# EAGLE design twister3-controller (EAGLE 8.3.2)
DESIGNER: Jon Newman; DESIGN_NAME: Twister3 Control Board; LICENSE: CERN OHL v1.2; REVISION: 1.1
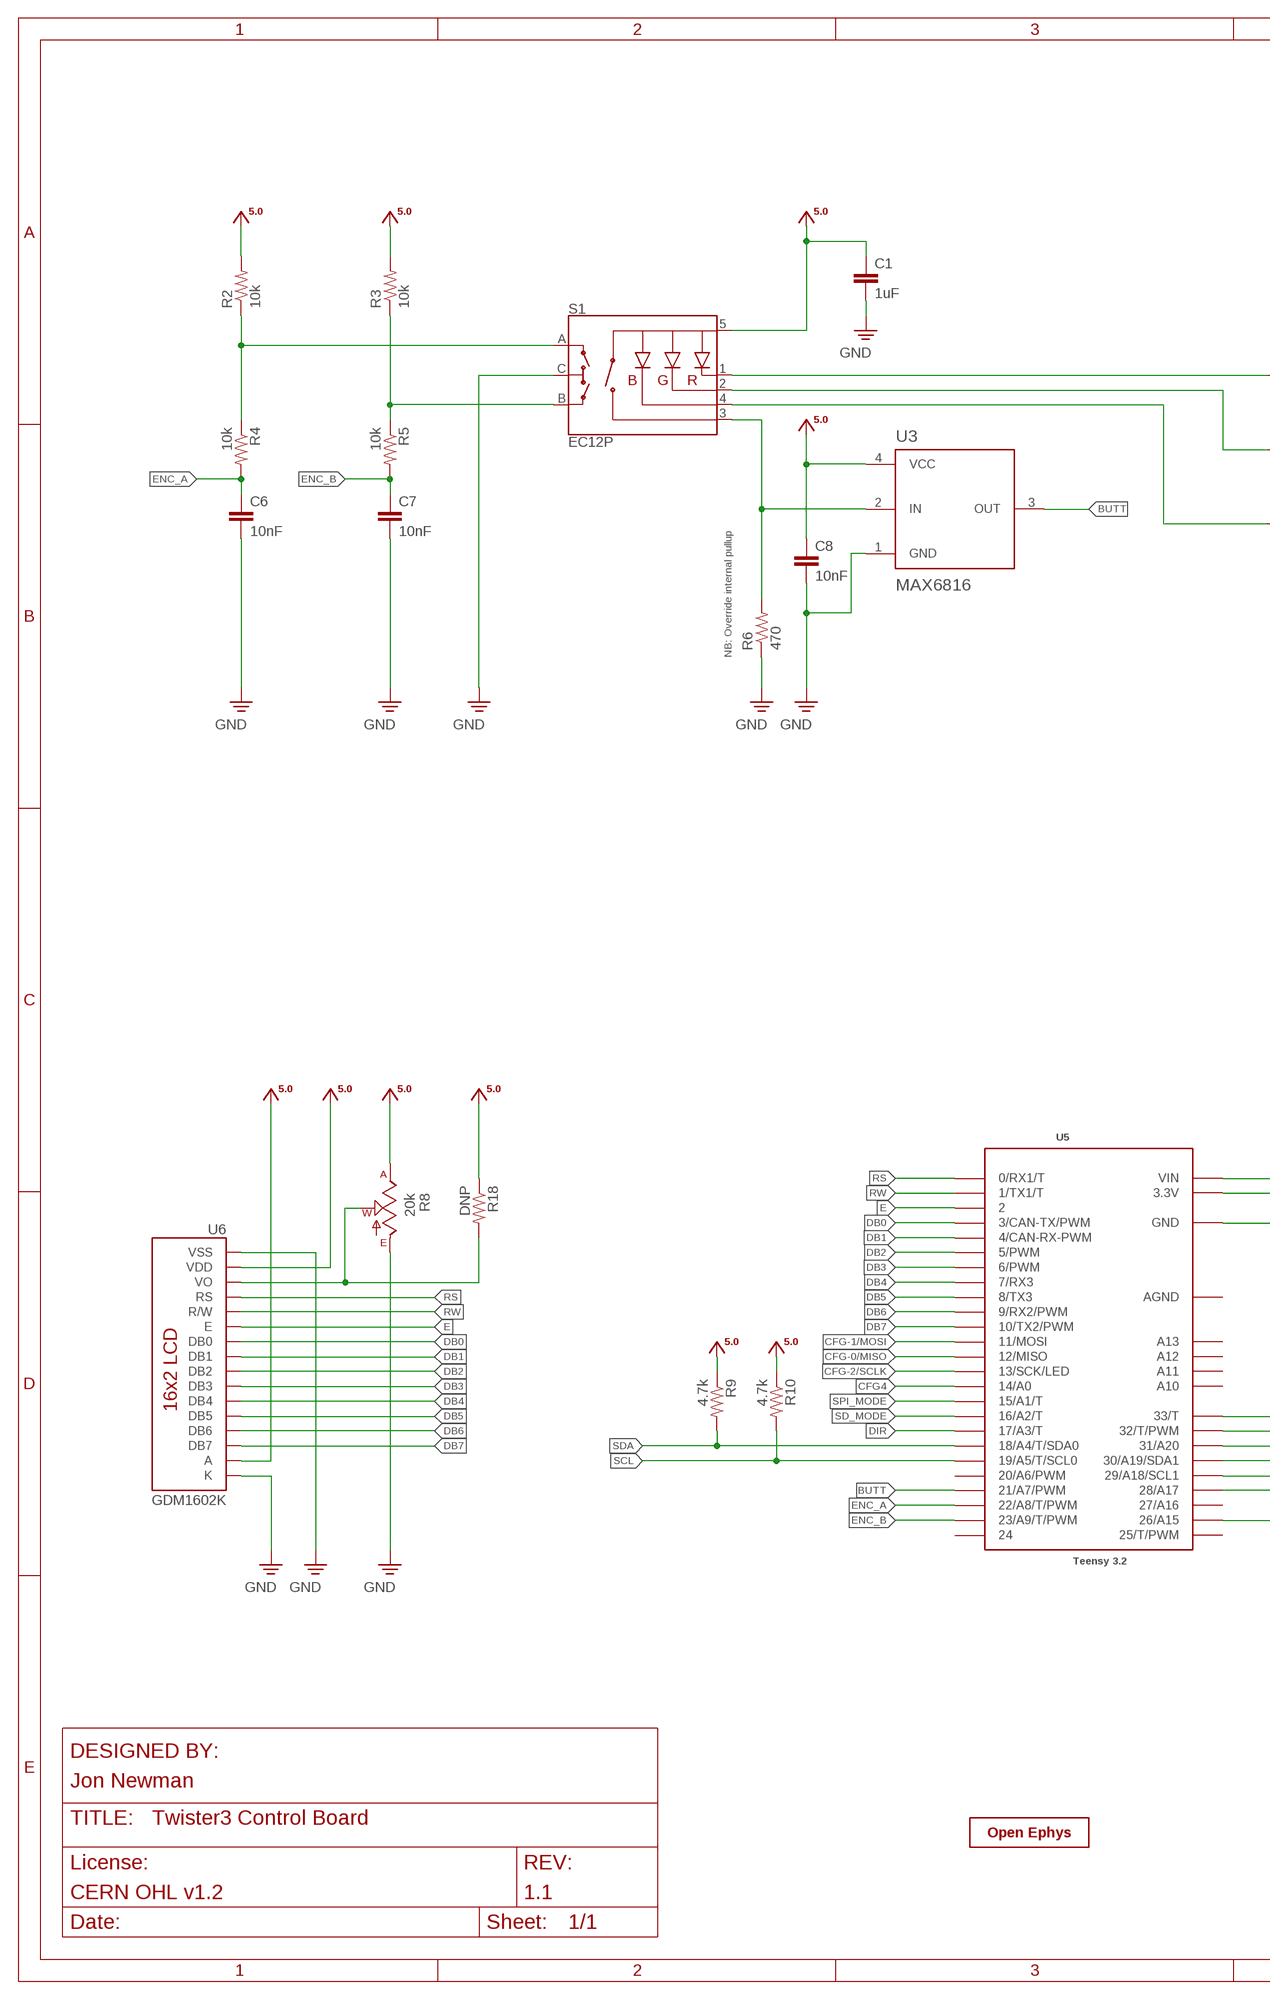
[diagram p0: schematic, sheet 1, part 1 of 2]
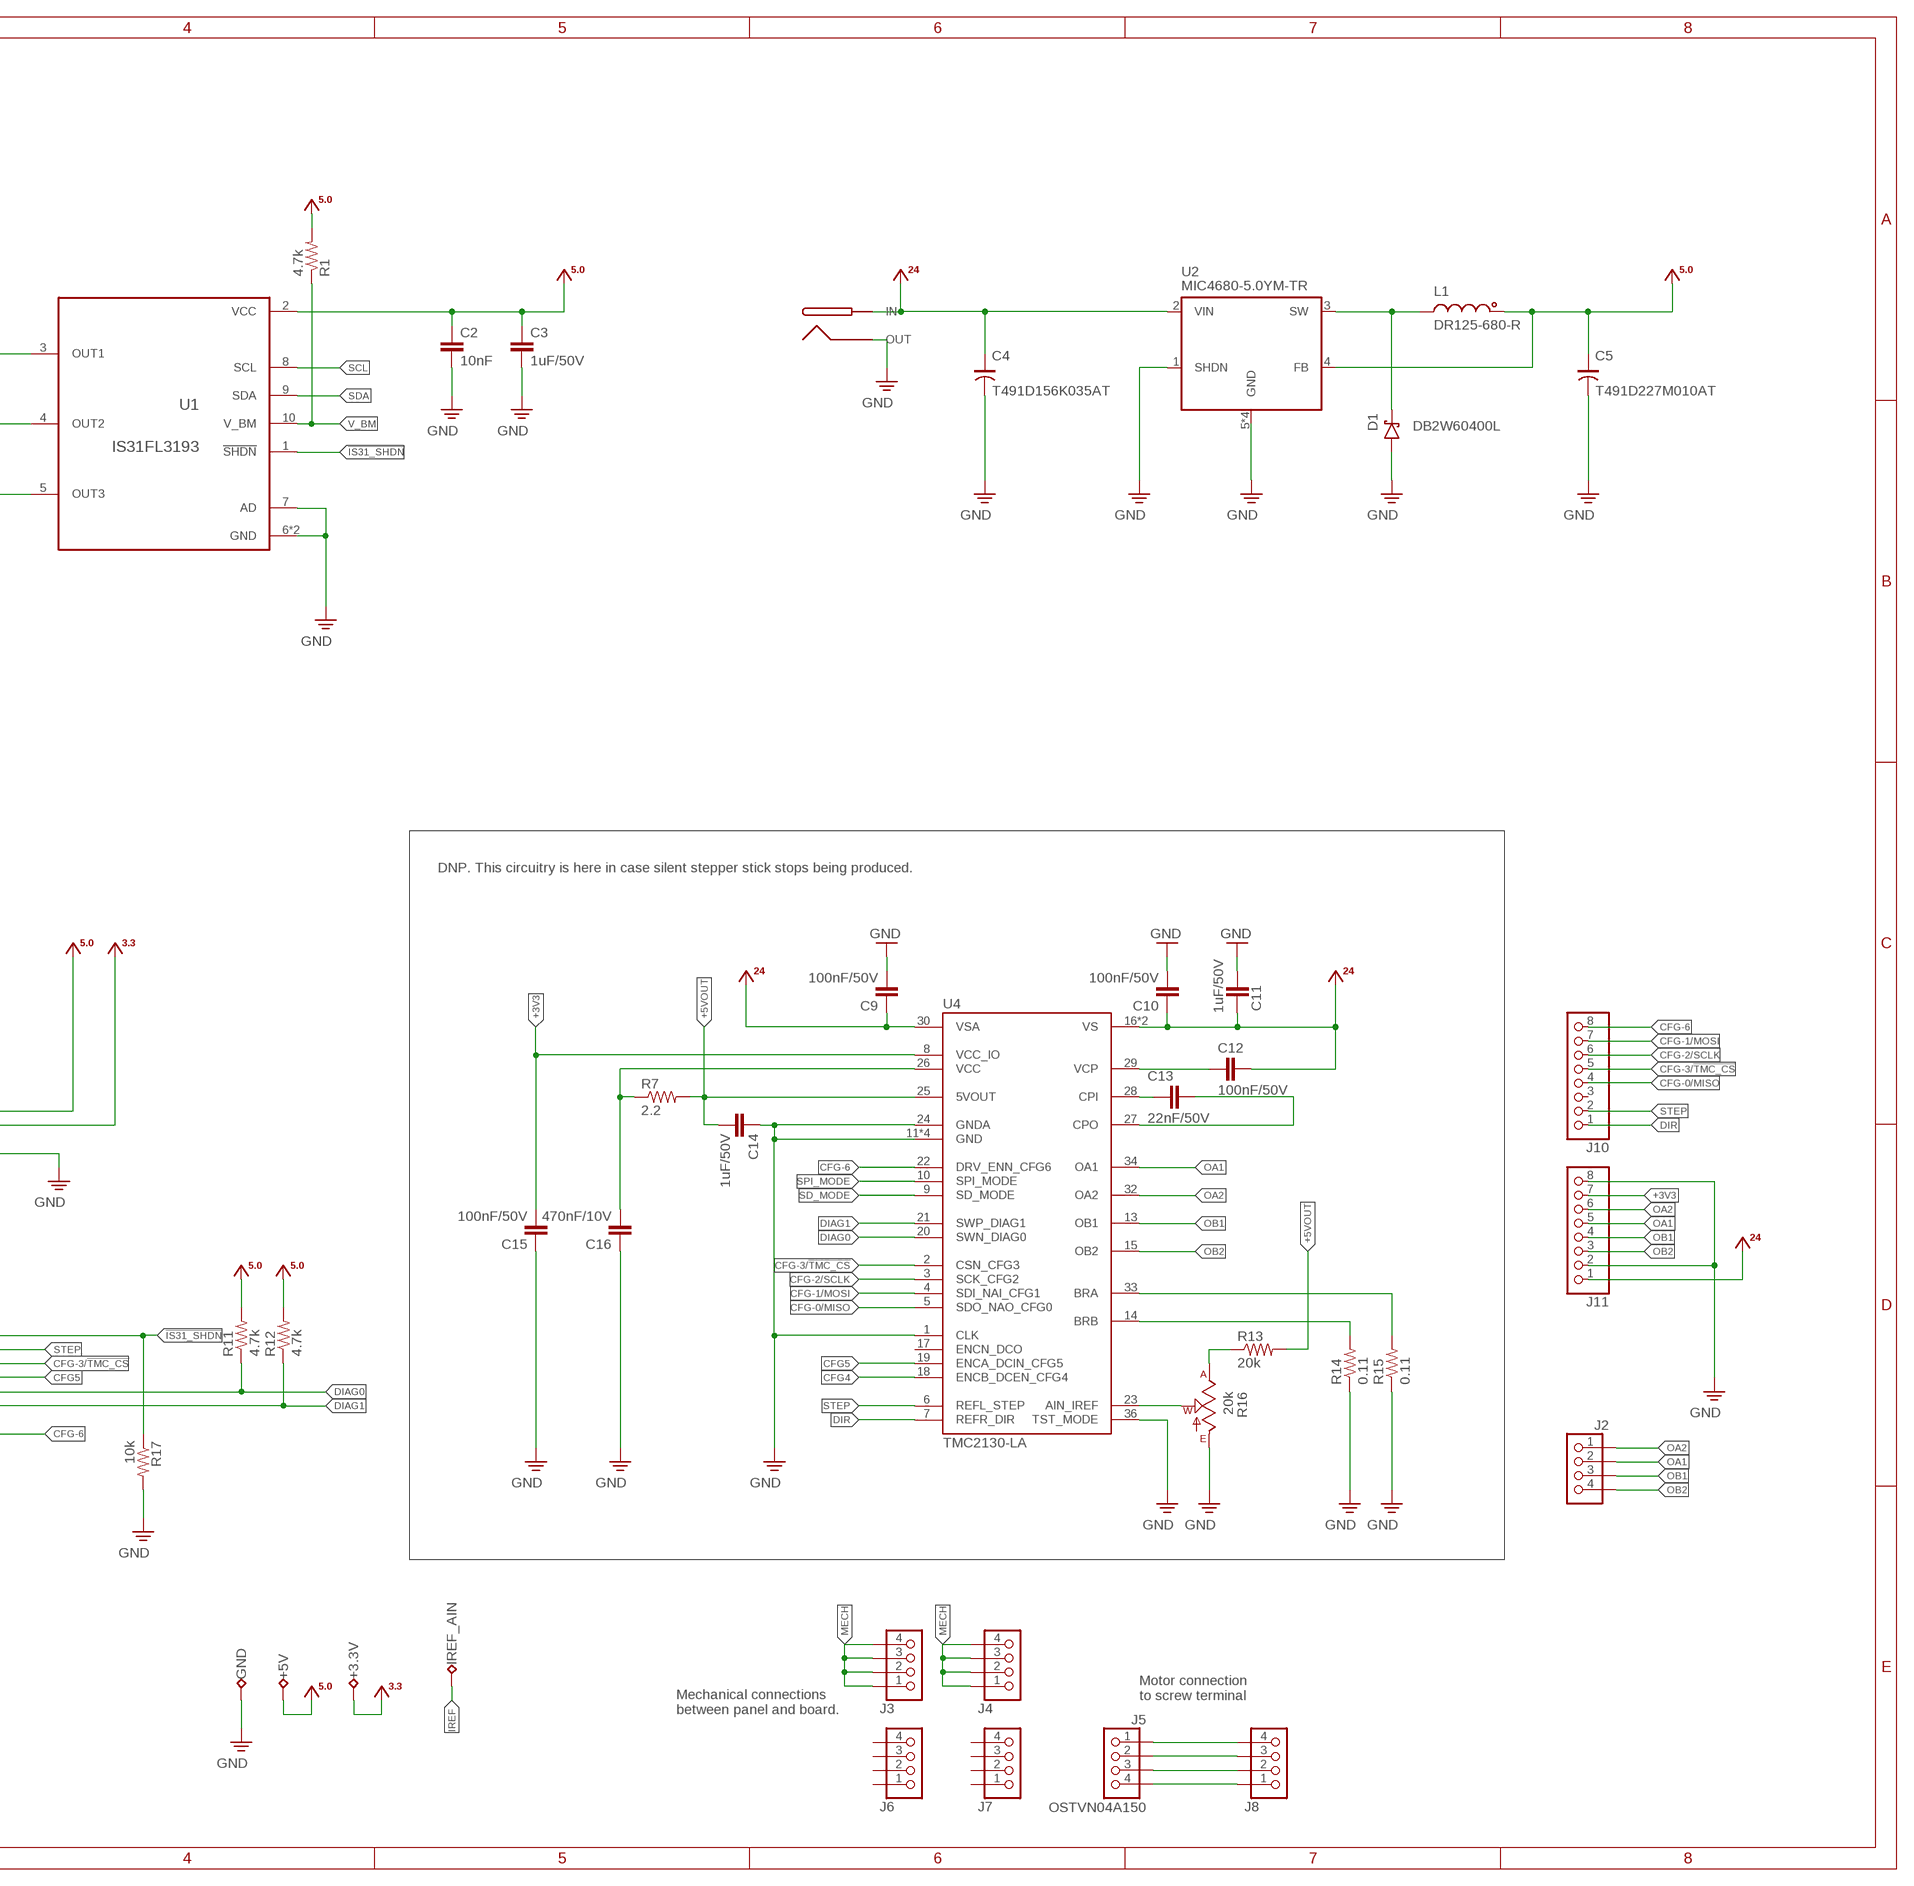
[diagram p1: schematic, sheet 1, part 2 of 2]

## Parts
+3.3V  TP_2MM  [TESTPOINT_2MM]
+5V  TP_2MM  [TESTPOINT_2MM]
C1  1uF  C_0603  [0603]
C2  10nF  C_0603  [0603]
C3  1uF/50V  C_0603  [0603]
C4  T491D156K035AT  C-POL_7343M  [7343M]
C5  T491D227M010AT  C-POL_7343M  [7343M]
C6  10nF  C_0603  [0603]
C7  10nF  C_0603  [0603]
C8  10nF  C_0603  [0603]
C9  100nF/50V  C_0603  [0603]
C10  100nF/50V  C_0603  [0603]
C11  1uF/50V  C_0603  [0603]
C12  100nF/50V  C_0603  [0603]
C13  22nF/50V  C_0402  [0402]
C14  1uF/50V  C_0603  [0603]
C15  100nF/50V  C_0603  [0603]
C16  470nF/10V  C_0402  [0402]
D1  DB2W60400L  S-DIODESOD-123  [SOD123]
GND  TP_2MM  [TESTPOINT_2MM]
IREF_AIN  TP_2MM  [TESTPOINT_2MM]
J1  BARREL-JACK_PJ-063BH  [PJ-063BH]
J2  PINHD-1X4  [1X04]
J3  PINHD-1X4_SMD-0.1"  [JP4_SMD]
J4  PINHD-1X4_SMD-0.1"  [JP4_SMD]
J5  OSTVN04A150  PINHD-1X4  [1X04]
J6  PINHD-1X4  [1X04]
J7  PINHD-1X4  [1X04]
J8  PINHD-1X4_SMD-0.1"  [JP4_SMD]
J10  PINHD-1X08_2.54-S  [1X08-S]
J11  PINHD-1X08_2.54-S  [1X08-S]
L1  DR125-680-R  L_DR125  [DR125]
R1  4.7k  R_0603  [0603]
R2  10k  R_0603  [0603]
R3  10k  R_0603  [0603]
R4  10k  R_0603  [0603]
R5  10k  R_0603  [0603]
R6  470  R_0603  [0603]
R7  2.2  R_0402  [0402]
R8  20k  TRIM_US-SM-42/43X  [SM-42/43X]
R9  4.7k  R_0603  [0603]
R10  4.7k  R_0603  [0603]
R11  4.7k  R_0603  [0603]
R12  4.7k  R_0603  [0603]
R13  20k  R_0603  [0603]
R14  0.11  R_0805  [0805]
R15  0.11  R_0805  [0805]
R16  20k  TRIM_US-SM-42/43X  [SM-42/43X]
R17  10k  R_0603  [0603]
R18  DNP  R_0603  [0603]
S1  EC12P  ENCODER-RGB-SWITCH  [ENCODER_LED_3]
U1  IS31FL3193  [PWSON-N10-3X3]
U2  MIC4680-5.0YM-TR  MIC4680_SOIC  [SOIC127P500X400-8N]
U3  MAX6816  [SOT143-4]
U4  TMC2130-LA  TMC21X0-LA  [QFN36-PAD]
U5  Teensy 3.2  TEENSY_3.1_CYCLOPS  [TEENSY_3.1_CYCLOPS]
U6  GDM1602K  LCD-16X2SILK  [LCD-16X2]
X1  OE-LOGO_14X10  [OE-LOGO-14X10]

## Nets
!IS31_SHDN: R17.1 U1.1(!SHDN) U5.33(33/T)
+3V3: +3.3V.1(TP) C15.2 J11.7 U4.8(VCC_IO) U5.3.3V U5.3.3V2(3.3V)
+5V0: +5V.1(TP) C1.1 C2.1 C3.1 C5.+ C8.1 L1.1 R1.2 R2.2 R3.2 R8.1(A) R9.1 R10.1 R11.2 R12.2 R18.1 S1.5(+) U1.2(VCC) U2.4(FB) U3.4(VCC) U5.VIN U6.2(VDD) U6.15(A)
+5VOUT: C14.2 R7.2 R13.2 U4.25(5VOUT)
+24V0: C4.+ C9.1 C10.1 C11.1 C12.1 J1.1(IN) J11.1 U2.2(VIN) U4.16(VS) U4.30(VSA) U4.31(VS) ; supply symbol labelled +24V
BRA1: R15.2 U4.33(BRA)
BRB1: R14.2 U4.14(BRB)
BUTT: U3.3(OUT) U5.21/A7(21/A7/PWM)
CFG4: U4.18(ENCB_DCEN_CFG4) U5.14/A0
CFG5: U4.19(ENCA_DCIN_CFG5) U5.30(30/A19/SDA1)
CFG-0/MISO: J10.4 U4.5(SDO_NAO_CFG0) U5.12(12/MISO)
CFG-1/MOSI: J10.7 U4.4(SDI_NAI_CFG1) U5.11(11/MOSI)
CFG-2/SCLK: J10.6 U4.3(SCK_CFG2) U5.13(13/SCK/LED)
CFG-3/!TMC_CS: J10.5 U4.2(CSN_CFG3) U5.31(31/A20)
CFG-6: J10.8 U4.22(DRV_ENN_CFG6) U5.26(26/A15)
CPI1: C13.2 U4.28(CPI)
CPO1: C13.1 U4.27(CPO)
DB0: U5.3(3/CAN-TX/PWM) U6.7(DB0)
DB1: U5.4(4/CAN-RX-PWM) U6.8(DB1)
DB2: U5.5(5/PWM) U6.9(DB2)
DB3: U5.6(6/PWM) U6.10(DB3)
DB4: U5.7(7/RX3) U6.11(DB4)
DB5: U5.8(8/TX3) U6.12(DB5)
DB6: U5.9(9/RX2/PWM) U6.13(DB6)
DB7: U5.10(10/TX2/PWM) U6.14(DB7)
DIAG0: R11.1 U4.20(SWN_DIAG0) U5.29(29/A18/SCL1)
DIAG1: R12.1 U4.21(SWP_DIAG1) U5.28(28/A17)
DIR: J10.1 U4.7(REFR_DIR) U5.17/A3(17/A3/T)
E: U5.2 U6.6(E)
ENC_A: C6.1 R4.2 U5.22/A8(22/A8/T/PWM)
ENC_B: C7.1 R5.2 U5.23/A9(23/A9/T/PWM)
GND: C1.2 C2.2 C3.2 C4.- C5.- C6.2 C7.2 C8.2 C9.2 C10.2 C11.2 C14.1 C15.1 C16.1 D1.A GND.1(TP) J1.2(OUT) J11.2 J11.8 R6.1 R8.3(E) R14.1 R15.1 R16.3(E) R17.2 S1.C U1.6(GND) U1.7(AD) U1.PAD(GND) U2.1(SHDN) U2.5(GND) U2.6(GND) U2.7(GND) U2.8(GND) U3.1(GND) U4.1(CLK) U4.11(GND) U4.12(GND) U4.24(GNDA) U4.35(GND) U4.36(TST_MODE) U4.TP(GND) U5.GND U5.GND2(GND) U6.1(VSS) U6.16(K)
IREF: IREF_AIN.1(TP) R16.2(W) U4.23(AIN_IREF)
MECH: J3.1 J3.2 J3.3 J3.4 J4.1 J4.2 J4.3 J4.4
N$1: R2.1 R4.1 S1.A
N$2: R6.2 S1.3(SW) U3.2(IN)
N$3: S1.1(-R) U1.3(OUT1)
N$4: R3.1 R5.1 S1.B
N$6: J5.1 J8.4
N$7: J5.2 J8.3
N$8: J5.3 J8.2
N$9: J5.4 J8.1
N$10: S1.2(-G) U1.4(OUT2)
N$11: R8.2(W) R18.2 U6.3(VO)
OA1: J2.2 J11.5 U4.34(OA1)
OA2: J2.1 J11.6 U4.32(OA2)
OB1: J2.3 J11.4 U4.13(OB1)
OB2: J2.4 J11.3 U4.15(OB2)
RS: U5.0(0/RX1/T) U6.4(RS)
RW: U5.1(1/TX1/T) U6.5(R/W)
SCL: R10.2 U1.8(SCL) U5.19/A5(19/A5/T/SCL0)
SD_MODE: U4.9(SD_MODE) U5.16/A2(16/A2/T)
SDA: R9.2 U1.9(SDA) U5.18/A4(18/A4/T/SDA0)
SPI_MODE: U4.10(SPI_MODE) U5.15/A1(15/A1/T)
STEP: J10.2 U4.6(REFL_STEP) U5.32(32/T/PWM)
SUPPY4: S1.4(-B) U1.5(OUT3)
SW: D1.C L1.2 U2.3(SW)
V_BM: R1.1 U1.10(V_BM)
VCC1: C16.2 R7.1 U4.26(VCC)
VCP1: C12.2 U4.29(VCP)
VREF2: R13.1 R16.1(A)
Unconnected: J6.1 J6.2 J6.3 J6.4 J7.1 J7.2 J7.3 J7.4 J10.3 U4.17(ENCN_DCO) U5.20/A6(20/A6/PWM) U5.24 U5.25(25/T/PWM) U5.27(27/A16) U5.A10 U5.A11 U5.A12 U5.A13

## Notes on the sheet
- NB: Override internal pullup
- DNP. This circuitry is here in case silent stepper stick stops being produced.
- Motor connection
  to screw terminal
- Mechanical connections
  between panel and board.

## Power pins joined to a net without a drawn wire
AGND: U5.AGND

## Library data of the parts
+3.3V +5V GND IREF_AIN = jonnew:TP: Test pad
C1-C3 C6-C16 = jonnew:C: Capacitor
C4 C5 = jonnew:C-POL: Polarized Capacitor
D1 = jonnew:S-DIODE: Schottky Diode
J1 = jonnew:BARREL-JACK
J2-J8 = jonnew:PINHD-1X4
J10 J11 = pinhead-2:PINHD-1X08: PIN HEADER
L1 = jonnew:L: Inductor
R1-R5 R9 R10 R13 R17 R18 = jonnew:R: Resistor; DK: PxxxxHTR-ND; MN: Panasonic; MPN: ERJ-3EKFxxxxV
R6 R11 R12 = cyclops:R: Resistor; DK: PxxxxHTR-ND; MN: Panasonic; MPN: ERJ-3EKFxxxxV
R7 R14 R15 = jonnew:R: Resistor
R8 R16 = jonnew:TRIM_US-: POTENTIOMETER
S1 = SparkFun-Switches:ENCODER-RGB-SWITCH: Illuminated Rotary Encoder w/ RGB LED and select switch Encoders rotate similarly to potentiometers, but they’re different from potentiometers in that an encoder has full rotation without limits. They output gray code so that you can tell how much and in which direction the encoder has been turned. This encoder includes an RGB LED and a push-down select switch. Part #: Top Up EC12PLRGBSDVBF-D <http://top-up.so-buy.com/front/bin/ptdetail.phtml?Part=EC12PLRGBSDVBF-D> SparkFun Products Rotary Encoder - Illuminated (RGB) <https://www.sparkfun.com/products/10982> (COM-10982); PROD_ID: RES-10859; SF_SKU: COM-10982
U1 = jonnew:IS31FL3193
U2 = jonnew:MIC4680
U3 = jonnew:MAX6816
U4 = we-chip:TMC21X0: Trinamic TMC21x0 Stepper Motor Driver (5V...46V, 1.2A RMS, 256 microsteps) TMC2100 - CFG pins for configuration (standalone) TMC2130 - SPI for configuration
U5 = jonnew:TEENSY_3.1_CYCLOPS
U6 = jonnew:LCD-16X2: Standard text-only 16x2 parallel input LCD Basic 16 character by 2 line display. Typically utilizes the extremely common HD44780 parallel interface chipset SparkFun Products: Basic 16x2 Green <https://www.sparkfun.com/products/255> Basic 8x2 Green <https://www.sparkfun.com/products/11122>; SF_ID: LCD-00255
X1 = jonnew:OE-LOGO

## Board
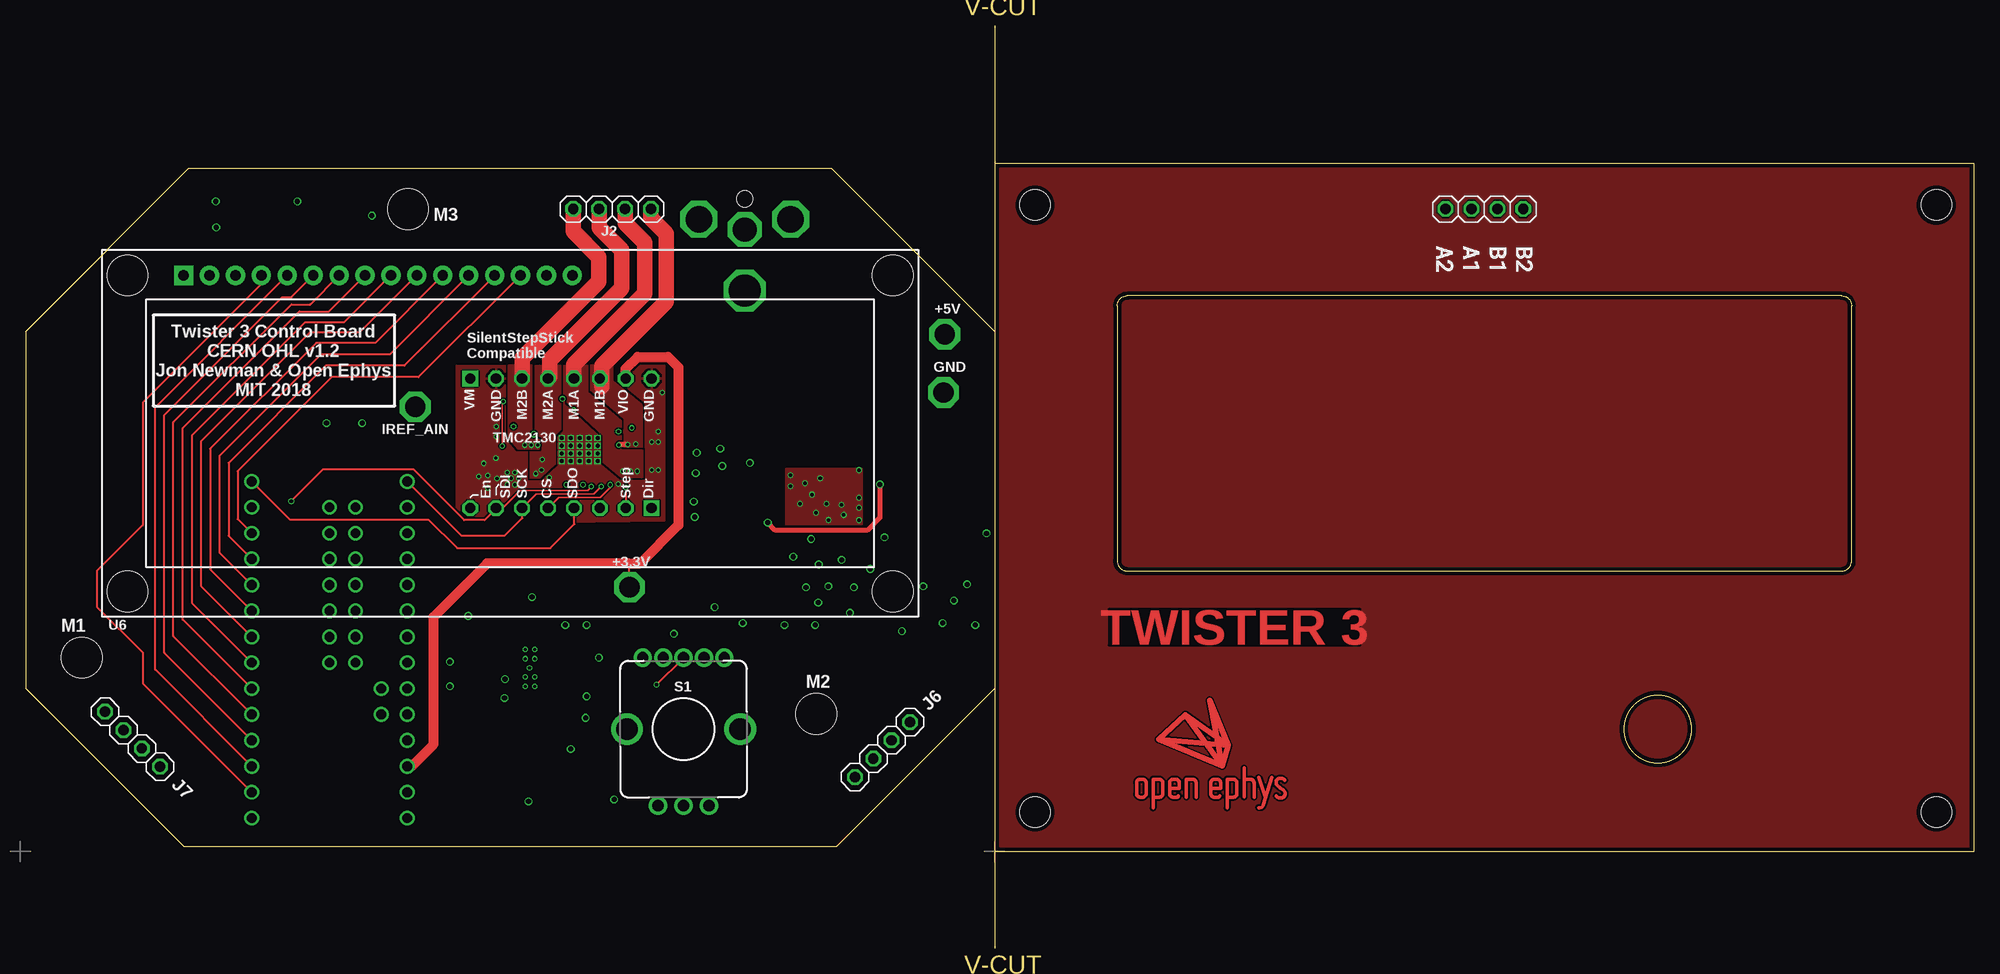
[diagram p2: board, top side]
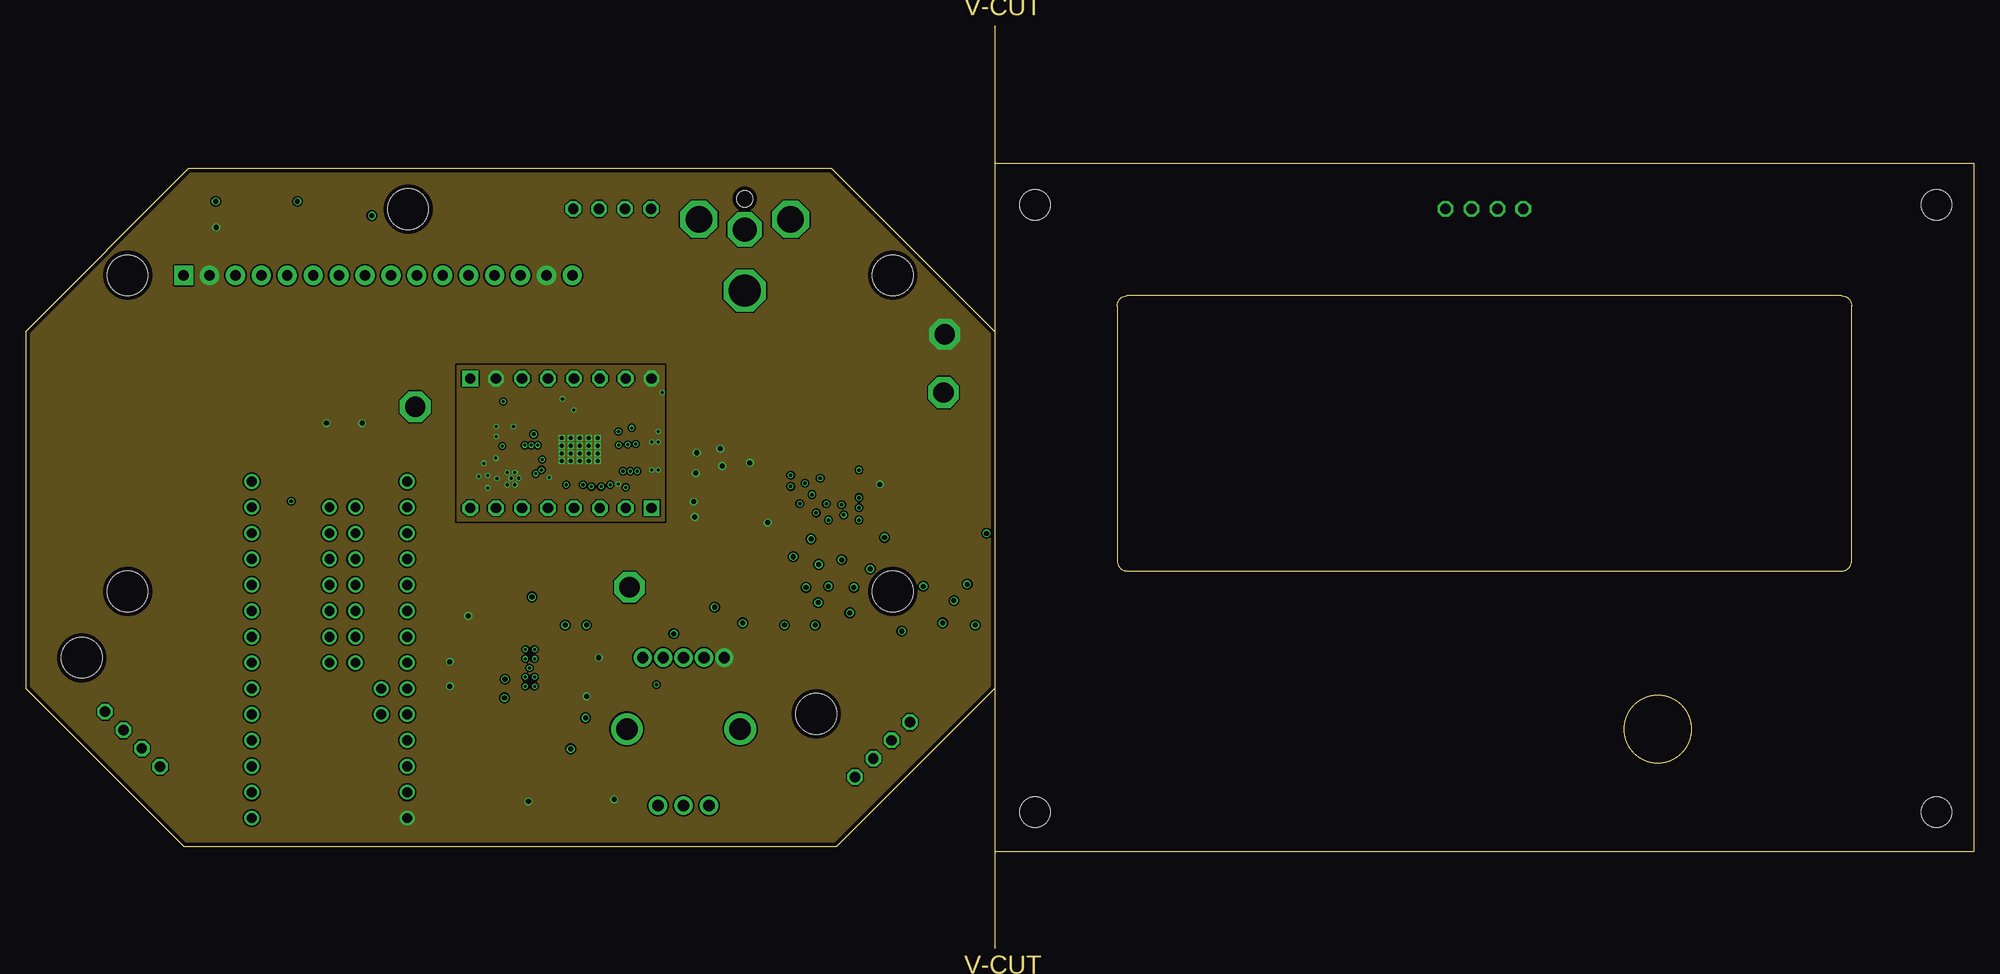
[diagram p3: board, inner layer Route2]
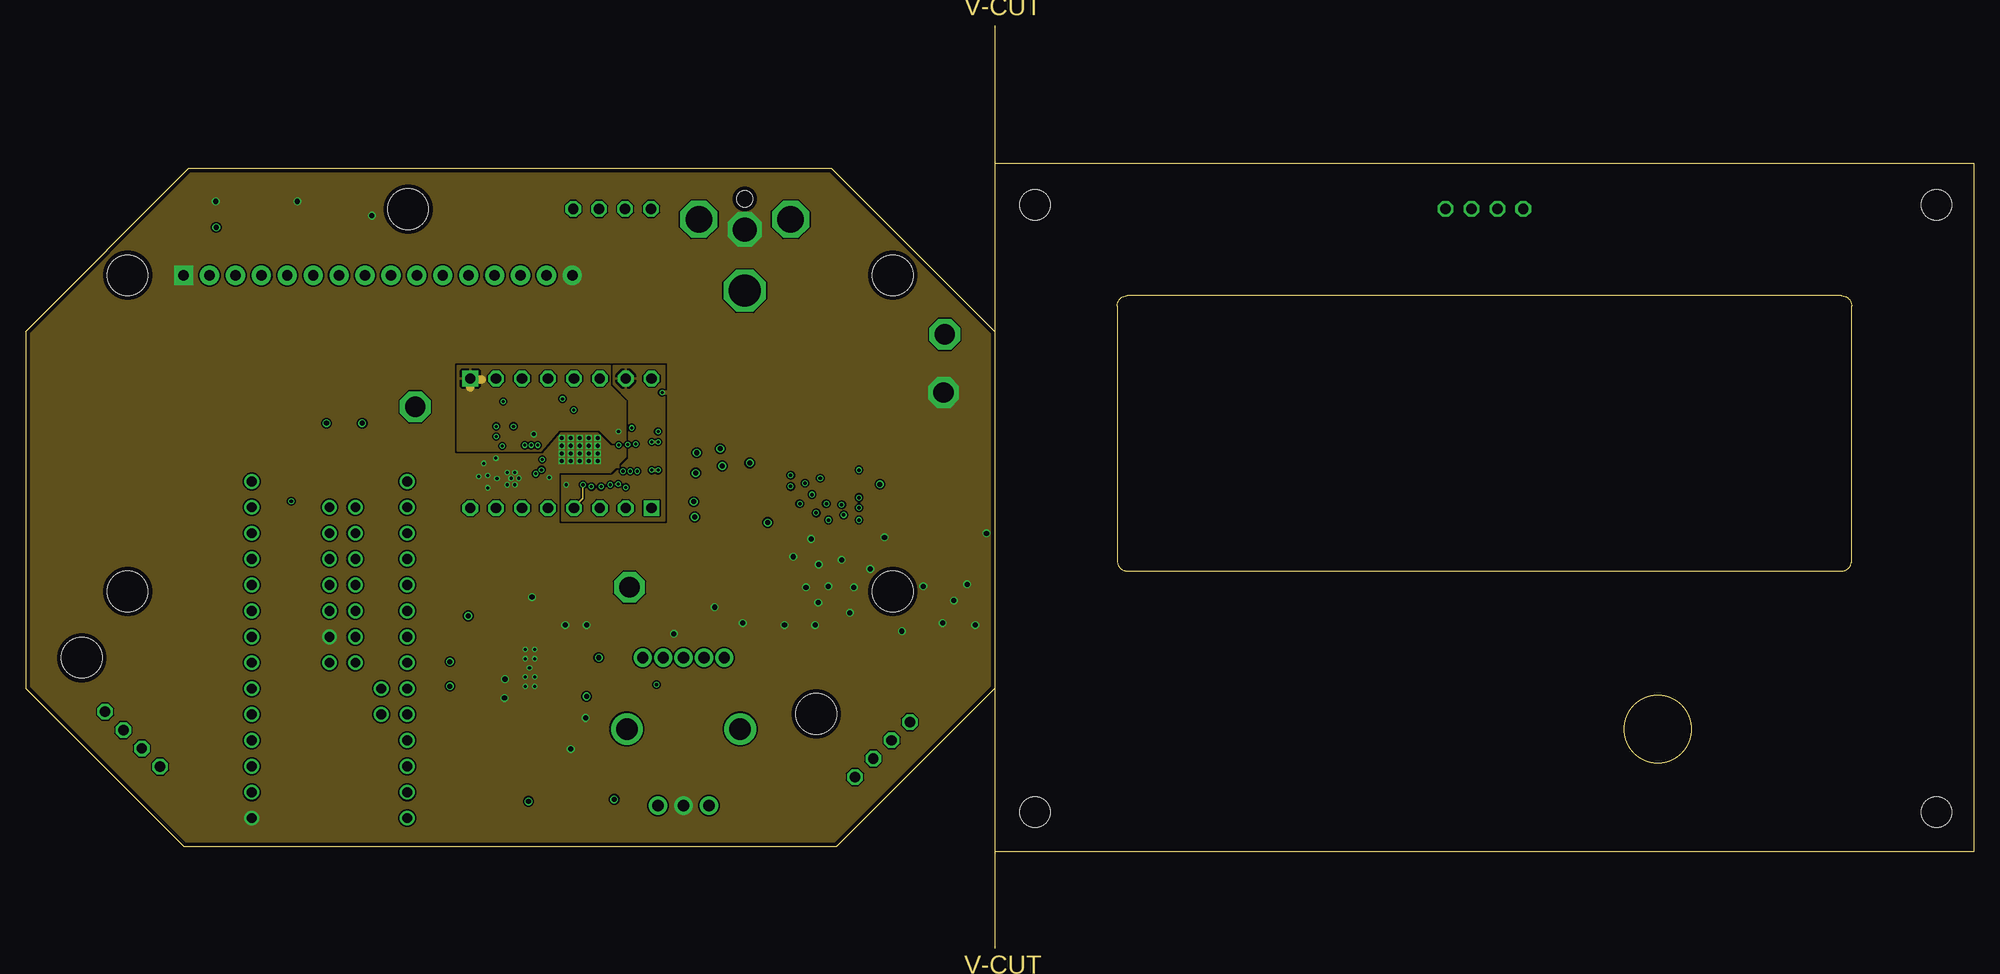
[diagram p4: board, inner layer Route15]
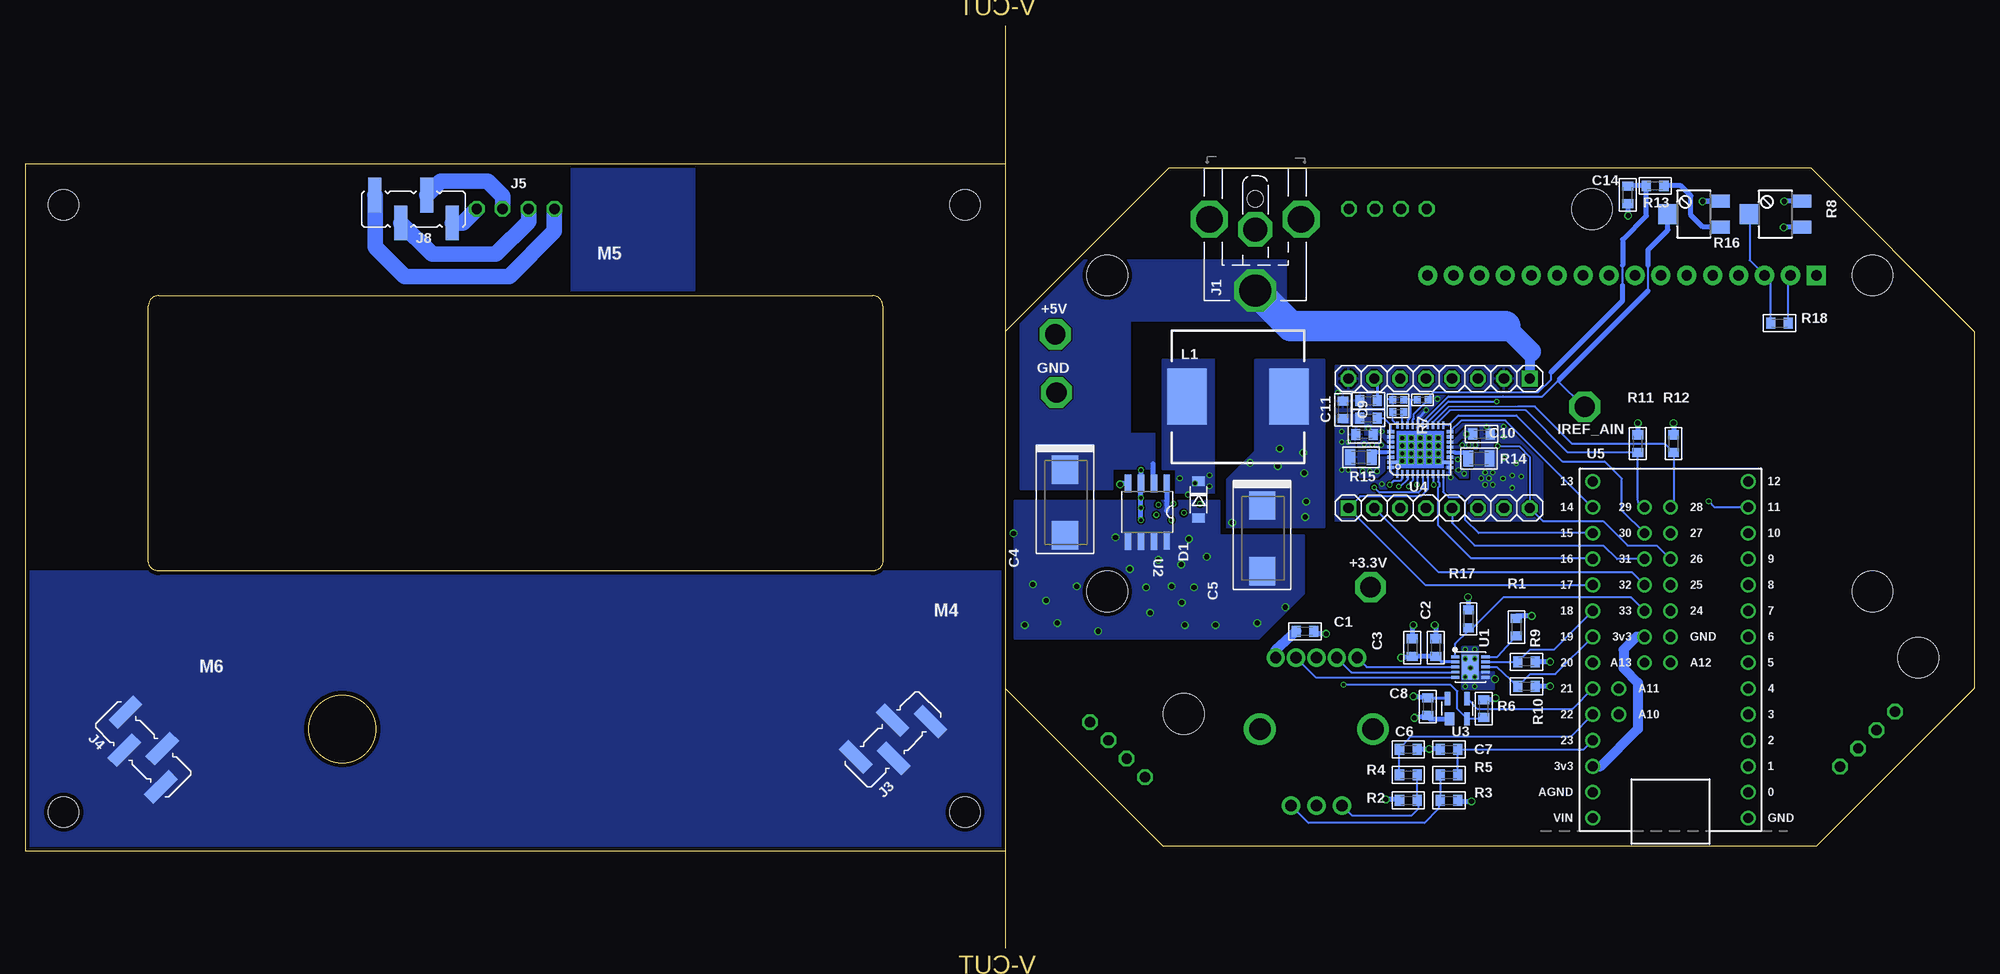
[diagram p5: board, bottom side, seen from below]

Size 191.04 x 90.5 mm. Coordinates in mm from the lower left corner, seen from the top.
Outline: 95,90.5 95,0
Outline: 95,9.5 191.04,9.5 191.04,76.96 95,76.96 95,9.5
Outline: 0,60.5 0,25.5 15.5,10 79.5,10 95,25.5 95,60.5 79,76.5 16,76.5 0,60.5
Outline: 107,63 107,38 arc90 108,37 178,37 arc90 179,38 179,63 arc90 178,64 108,64 arc90 107,63
Outline: circle at 160,21.5 radius 3.3
Copper layers (1*2*15*16): Top 0.035mm / dielectric 0.2mm / Route2 0.0175mm / dielectric 0.3mm / Route15 0.0175mm / dielectric 0.2mm / Bottom 0.035mm
Design rules "seeed-studio-4-layer": minimum track width 6mil, minimum drill 0.3mm, track to track 6mil, track to pad 6mil, pad to pad 6mil, via to via 6mil, smd to smd 0mil, copper to edge 0.4mm, drill to drill 10mil, minimum pad ring 6mil, minimum via ring 4mil, stop-mask expansion 4mil, vias tented up to drill 100mil, thermal gap 10mil
Holes 3 mm at 98.96,13.35 98.96,72.89 187.3,72.89 187.3,13.35
Holes 4 mm at 5.5,28.5 77.5,23 37.5,72.5
tKeepout: area 2,25 to 9,32; area 74,19.5 to 81,26.5; area 34,69 to 41,76

### Footprints (pad centres in the part's own frame; a part is rotated, then mirrored left to right if it is on the bottom)
TESTPOINT_2MM = drill 2 octagon: 1 0,0
0603 = smd 0.889 x 1.067: 1 -0.864,0; 2 0.864,0
7343M = smd 2.77 x 2.55: + -3.22,0; - 3.22,0
0402 = smd 0.686 x 0.762: 1 -0.533,0; 2 0.533,0
SOD123 = smd 0.914 x 1.219: A -1.8,0; C 1.8,0
PJ-063BH = drill 3.1 octagon: 1 0,-12 | drill 2.35 octagon: 2 0,-6 | drill 2.6 octagon: M1 -4.5,-5.004; M2 4.5,-5.004 | hole 1.6: 0,-3
1X04 = drill 1.016 octagon: 1 -3.81,0; 2 -1.27,0; 3 1.27,0; 4 3.81,0
JP4_SMD = smd 1.27 x 3.4: 1 -3.81,1.37; 2 -1.27,-1.37; 3 1.27,1.37; 4 3.81,-1.37
1X08-S = drill 1.016 square: 1 -8.89,0 | drill 1.016 octagon: 2 -6.35,0; 3 -3.81,0; 4 -1.27,0; 5 1.27,0; 6 3.81,0; 7 6.35,0; 8 8.89,0
DR125 = smd 3.85 x 5.5: 1 -5,0; 2 5,0
SM-42/43X = smd 1.3 x 1.9: 1 -1.27,-2.55; 3 1.27,-2.55 | smd 2 x 1.9: 2 0,2.55
0805 = smd 0.965 x 1.524: 1 -1.041,0; 2 1.041,0
ENCODER_LED_3 = drill 1.1 pad 1.778: 1 -4,7; 2 -2,7; 3 0,7; 4 2,7; 5 4,7 | drill 1.1 pad 1.8: A -2.5,-7.5; B 2.5,-7.5; C 0,-7.5 | drill 2.1: M1 -5.55,0; M2 5.55,0
PWSON-N10-3X3 = smd 0.8 x 0.28: 1 -1.475,1; 2 -1.475,0.5; 3 -1.475,0; 4 -1.475,-0.5; 5 -1.475,-1; 6 1.475,-1; 7 1.475,-0.5; 8 1.475,0; 9 1.475,0.5; 10 1.475,1 | smd 1.65 x 2.4: PAD 0,0
SOIC127P500X400-8N = smd 1.778 x 0.635: 1 -2.819,1.905; 2 -2.819,0.635; 3 -2.819,-0.635; 4 -2.819,-1.905; 5 2.819,-1.905; 6 2.819,-0.635; 7 2.819,0.635; 8 2.794,1.905
SOT143-4 = smd 0.94 x 1.31: 1 -0.77,-1 | smd 0.55 x 1.31: 2 0.96,-1; 3 0.96,1; 4 -0.96,1
QFN36-PAD = smd 0.7 x 0.26: 1 -2.4,2.25; 2 -2.4,1.75; 3 -2.4,1.25; 4 -2.4,0.75; 5 -2.4,0.25; 6 -2.4,-0.25; 7 -2.4,-0.75; 8 -2.4,-1.25; 9 -2.4,-1.75; 10 -2.4,-2.25; 19 2.4,-2.25; 20 2.4,-1.75; 21 2.4,-1.25; 22 2.4,-0.75; 23 2.4,-0.25; 25 2.4,0.75; 26 2.4,1.25; 27 2.4,1.75; 28 2.4,2.25 | smd 0.26 x 0.7: 11 -1.75,-2.9; 13 -0.75,-2.9; 14 -0.25,-2.9; 15 0.25,-2.9; 16 0.75,-2.9; 17 1.25,-2.9; 18 1.75,-2.9; 29 1.75,2.9; 30 1.25,2.9; 31 0.75,2.9; 32 0.25,2.9; 33 -0.25,2.9; 34 -0.75,2.9; 36 -1.75,2.9 | smd 0.26 x 1.2: 12 -1.25,-2.65; 35 -1.25,2.65 | smd 1.2 x 0.26: 24 2.15,0.25 | smd 0.6 x 0.6: TP 0,0
TEENSY_3.1_CYCLOPS = drill 0.965: 0 7.62,3.81; 1 7.62,6.35; 2 7.62,8.89; 3 7.62,11.43; 3.3V -7.62,6.35; 3.3V2 -2.54,19.05; 4 7.62,13.97; 5 7.62,16.51; 6 7.62,19.05; 7 7.62,21.59; 8 7.62,24.13; 9 7.62,26.67; 10 7.62,29.21; 11 7.62,31.75; 12 7.62,34.29; 13 -7.62,34.29; 14/A0 -7.62,31.75; 15/A1 -7.62,29.21; 16/A2 -7.62,26.67; 17/A3 -7.62,24.13; 18/A4 -7.62,21.59; 19/A5 -7.62,19.05; 20/A6 -7.62,16.51; 21/A7 -7.62,13.97; 22/A8 -7.62,11.43; 23/A9 -7.62,8.89; 24 0,21.59; 25 0,24.13; 26 0,26.67; 27 0,29.21; 28 0,31.75; 29 -2.54,31.75; 30 -2.54,29.21; 31 -2.54,26.67; 32 -2.54,24.13; 33 -2.54,21.59; A10 -5.08,11.43; A11 -5.08,13.97; A12 0,16.51; A13 -2.54,16.51; AGND -7.62,3.81; GND 7.62,1.27; GND2 0,19.05; VIN -7.62,1.27
LCD-16X2 = drill 1.016 pad 1.88 square: 1 -32,15.5 | drill 1.016 pad 1.88: 2 -29.46,15.5; 3 -26.92,15.5; 4 -24.38,15.5; 5 -21.84,15.5; 6 -19.3,15.5; 7 -16.76,15.5; 8 -14.22,15.5; 9 -11.68,15.5; 10 -9.14,15.5; 11 -6.6,15.5; 12 -4.06,15.5; 13 -1.52,15.5; 14 1.02,15.5; 15 3.56,15.5; 16 6.1,15.5 | hole 4: -37.5,15.5; -37.5,-15.5; 37.5,15.5; 37.5,-15.5

### Placement (x,y rotation side)
+3.3V  59.2,35.4 0 top
+5V  90.1,60.2 0 top
C1  65.61,31.09 0 bottom
C2  52.8,29.5 90 bottom
C3  55.1,29.5 90 bottom
C4  89.15,43.72 270 bottom
C5  69.84,40.21 270 bottom
C6  55.5,19.5 0 bottom
C7  51.5,19.5 180 bottom
C8  53.6,23.7 270 bottom
C9  59.8,50.4 180 bottom
C10  48.32,50.42 0 bottom
C11  61.9,52.8 90 bottom
C12  59.4,52 0 bottom
C13  56.5,52.6 180 bottom
C14  34,73.9 90 bottom
C15  59.4,53.7 0 bottom
C16  56.5,53.8 0 bottom
D1  76.05,44 90 bottom
GND  90,54.5 0 top
IREF_AIN  38.2,53.1 0 top
J1  70.5,76.5 0 bottom
J2  57.5,72.5 180 top
J3  106,20.5 225 bottom
J4  179.5,19.5 315 bottom
J5  143,72.5 0 top
J6  84,19.5 45 top
J7  10.5,20.5 135 top
J8  153,72.5 180 bottom
J10  52.48,43.18 0 bottom
J11  52.48,55.88 180 bottom
L1  72.2,54.1 180 bottom
R1  44.9,31.5 90 bottom
R2  55.5,14.5 180 bottom
R3  51.5,14.5 0 bottom
R4  55.5,17 180 bottom
R5  51.5,17 0 bottom
R6  48.1,23.5 270 bottom
R7  54.1,53.8 0 bottom
R8  19.5,72 90 bottom
R9  43.9,28.1 180 bottom
R10  43.9,25.7 180 bottom
R11  33,49.5 90 bottom
R12  29.5,49.5 90 bottom
R13  31.3,74.77 180 bottom
R14  48.57,48.03 180 bottom
R15  60.14,48.16 0 bottom
R16  27.5,72 90 bottom
R17  49.6,32.3 90 bottom
R18  19.1,61.3 180 bottom
S1  64.5,21.5 0 top
U1  49.41,27.58 0 bottom
U2  81.08,42.78 270 bottom
U3  50.7,23.5 0 bottom
U4  54.32,48.91 90 bottom
U5  29.8,11.5 0 bottom
U6  47.5,50.5 0 top
X1  115.5,17.5 0 top

### Tracks (layer width: path | path; a pad name or v marks a point on that pad's centre or on a via)
!IS31_SHDN
  Bottom 0.2: U1.1 50.88,29.89 49.67,31.1 | 49.6,31.1 49.5,31.1 46.2,34.4 33.65,34.4 U5.33 | 49.6,31.1 49.67,31.1 | 49.67,31.1 49.67,31.33 R17.1 49.6,31.1
+3V3  (via drill 0.3)
  Top 0.2: +3.3V.1 59.2,37.51 arc45 59.1,37.75
  Top 1: U5.3.3V 37.85,17.85 40,20 40,32.5 45.25,37.75 59.1,37.75 60.25,37.75 64,41.5 64,57 63,58 60,58 58.83,56.83 J11.7
  Route15 0.18: v52.99,45.46 52.85,45.36
  Bottom 0.18: U4.8 53.07,45.54 v52.99,45.46
  Bottom 0.3: J11.7 58.54,55.88 C15.2
  Bottom 1: U5.3.3V 36.65,17.85 33,21.5 33,26.05 34.4,27.45 34.4,29.3 33.15,30.55 U5.3.3V2
  pour Route15: 57.67,57.17 62.63,57.17 62.63,41.93 52.6,41.93 52.6,46.38 57.55,46.38 59.2,48.03 59.19,53.74 57.67,55.27
+5V0  (via drill 0.5)
  Top 0.5: v83.75,45.5 83.75,42.25 82.5,41 73.5,41 v72.75,41.75
  Bottom 0.203: R18.1 18.24,65.8 U6.2
  Bottom 0.3: U1.2 52.24,28.08 C2.1 | C8.1 51.72,24.56 U3.4
  Bottom 0.5: C2.1 C3.1 56.16,28.46 v56.2,28.5 | U2.4 83.65,45.6 v83.75,45.5 | v29.5,51.5 R12.2 | v33,51.5 R11.2 | R3.2 50.36,14.4 v49.3,14.4 | R2.2 56.64,14.6 v57.7,14.6 | v41.6,25.7 R10.1 | v41.6,28.1 R9.1 | C1.1 66.65,30.95 | C8.1 54.96,24.74 v55,24.7 | v43.4,32.6 44.84,32.6 R1.2 | R8.1 18.67,70.73 v18.7,70.7
  Bottom 1: S1.5 68.5,29.24 C1.1
  Bottom 1.5: 70.08,43.25 C5.+
  other vias: 65.6,42.3 65.5,43.8 65.7,46.6 68.1,49 68.3,47.3 65.8,48.6 71,47.6
  pour Route2 (rank 2, no thermals): -11.5,-5.5 -11.5,104.5 236.5,104.5 236.5,-5.5
  pour Bottom (no thermals): 63.75,57.75 63.75,41.25 73.25,41.25 73.25,46 70.5,48.75 70.5,57.75
+5VOUT
  Bottom 0.2: 41.5,56.5 41.5,55.8 42.76,54.54 52.99,54.54 53.54,53.99 53.54,53.83 R7.2 54.04,53.33 | 34.5,65 34.5,67 | 54.04,53.31 54.04,53.33 | 54.04,53.31 54.04,53.33 | 54.04,53.31 54.95,52.41 54.95,51.95 55.07,51.83 U4.25
  Bottom 0.5: 34.5,65 34.5,63.5 41.5,56.5 | 34.5,67 34.5,69.5 32.16,71.84 R13.2 C14.2
+24V0  (via drill 0.3, 0.4)
  Route15 0.813: 43.71,55.77 44.72,55.77 | 43.58,55.77 43.58,54.98
  Bottom 0.5: U2.2 80.5,45.6 80.5,47.5
  Bottom 1: 43.5,58.5 43.59,58.5 J11.1
  Bottom 2: 46,61 43.5,58.5
  Bottom 3: J1.1 67,61 46,61
  other vias: 59.42,51.04 49.82,50.41 58.13,50.67
  pour Bottom (no thermals): 57.01,49.6 57.51,49.6 57.58,49.66 58.2,50.32 59.7,50.32 59.7,51.51 62.02,51.53 62.02,52.32 60.26,52.38 59.95,52.38 59.63,52.07 58.36,52.07 57.88,51.59 57.88,50.48 57.6,50.2 57.01,50.2
  pour Bottom (no thermals): 51.64,49.6 50.76,49.6 50.27,50.09 48.76,50.09 48.76,50.97 49.88,50.97 51.14,49.72 51.64,49.72
  pour Route15: 42.31,57.17 42.31,48.79 50.5,48.79 52.28,50.82 56.28,50.82 57.55,49.55 58.82,49.55 58.82,53.61 57.3,55.14 57.3,57.17
  pour Bottom (no thermals): 67.5,67.5 67.5,61.5 82.8,61.5 82.8,50.5 80.4,50.5 80.4,47 84.5,47 84.5,45 93.5,45 93.5,67.5
BRA1
  Bottom 0.254: 58.94,48.41 R15.2 | U4.33 57.67,48.66 57.69,48.64
  Bottom 0.406: 57.69,48.64 58.71,48.64 R15.2
BRB1
  Bottom 0.16: 50.13,48.64 R14.2
  Bottom 0.254: U4.14 50.98,48.66 50.96,48.64
  Bottom 0.406: 50.96,48.64 50.13,48.64
BUTT
  Bottom 0.2: U3.3 48.74,23.5 39.39,23.5 U5.21/A7
CFG4
  Bottom 0.2: U5.14/A0 37.45,43.25 45.98,51.78 50.3,51.78 U4.18
CFG5
  Bottom 0.18: U4.19 52.07,51.46 52.04,51.46
  Bottom 0.2: U5.30 34.56,42.94 34.56,46.06 36.25,47.75 40.39,47.75 44.89,52.26 50.6,52.26 51.55,51.31 U4.19
CFG-0/MISO  (via drill 0.3)
  Top 0.2: J10.4 53.8,43.13 53.8,41.6 51.45,39.25 42.3,39.25 39.5,42.05 25.92,42.05 U5.12
  Route15 0.16: v54.64,45.46 54.63,44.09 J10.4
  Bottom 0.2: U4.5 54.57,45.53 v54.64,45.46
CFG-1/MOSI  (via drill 0.3, 0.35)
  Top 0.16: v55.47,45.27 55.09,44.89 48.48,44.89 46.77,43.18 J10.7
  Top 0.2: v26.05,43.85 29.2,47 38,47 43,42 45,42 46.13,43.13 J10.7
  Bottom 0.18: 55.07,45.86 55.47,45.46 v55.47,45.27
  Bottom 0.2: U4.4 55.07,45.86 | U5.11 25.45,43.25 v26.05,43.85
CFG-2/SCLK  (via drill 0.3)
  Top 0.16: v56.42,45.27 55.72,44.57 50.07,44.57 48.7,43.2 J10.6
  Top 0.2: U5.13 42.71,40.5 47,40.5 48.7,42.2 48.7,43.2
  Bottom 0.18: 55.57,45.99 56.29,45.27 v56.42,45.27
  Bottom 0.2: U4.3 55.57,45.99
CFG-3/!TMC_CS  (via drill 0.3)
  Top 0.16: v57.31,45.46 57.31,45.18 56.35,44.22 52.26,44.22 J10.5
  Bottom 0.18: 56.07,46.06 56.29,45.84 56.93,45.84 v57.31,45.46
  Bottom 0.2: J10.5 51.21,41.71 49,39.5 36.37,39.5 35.04,38.17 U5.31 | U4.2 56.07,46.06
CFG-6  (via drill 0.3 pad 0.41)
  Top 0.16: v46.73,49.25 46.73,53.54 v46.82,53.63
  Bottom 0.16: U4.22 53.57,51.63 51.57,53.63
  Bottom 0.2: U5.26 31.13,39.5 34,39.5 36.4,41.9 42.32,41.9 J10.8 43.59,48.19 44.65,49.25 v46.73,49.25 | 51.57,53.63 v46.82,53.63
CPI1
  Bottom 0.2: U4.28 57.03,51.77 C13.2
CPO1
  Bottom 0.2: U4.27 56.07,52.6 C13.1
DB0
  Top 0.2: U5.3 14.5,30.61 14.5,51.6 26.05,63.15 27.89,63.15 U6.7
DB1
  Top 0.2: U5.4 15.4,32.25 15.4,51 26.85,62.45 29.73,62.45 U6.8
DB2
  Top 0.2: U5.5 16.3,33.89 16.3,50.3 27.38,61.38 31.2,61.38 U6.9
DB3
  Top 0.2: U5.6 17.2,35.53 17.2,49.7 27.88,60.38 32.73,60.38 U6.10
DB4
  Top 0.2: U5.7 18.1,37.17 18.1,49 28.48,59.38 34.27,59.38 U6.11
DB5
  Top 0.2: U5.8 19,38.81 19,48.3 28.95,58.25 35.69,58.25 U6.12
DB6
  Top 0.2: U6.13 46,65.98 37.15,57.12 29.43,57.12 19.9,47.6 19.9,40.45 U5.9
DB7
  Top 0.2: U5.10 20.8,42.09 20.8,46.8 30,56 38.52,56 U6.14
DIAG0
  Bottom 0.16: 51.4,52.77 51.47,52.77 | 51.4,52.77 44,52.77 | 51.4,52.77 52.27,51.89 52.28,51.89 52.57,51.6 U4.20
  Bottom 0.2: U5.29 arc90 33,43.91 R11.1 39.87,48.64 44,52.77
DIAG1
  Bottom 0.16: 44.4,53.15 44.75,53.15 46.9,53.15 46.91,53.14 51.54,53.14 53.07,51.6 U4.21
  Bottom 0.2: U5.28 arc-90 29.5,43.55 R12.1 30.36,49.5 39.45,49.5 43.1,53.15 44.75,53.15
DIR
  Bottom 0.18: J10.1 60.23,44.32 54.26,44.32 53.57,45.01 U4.7
  Bottom 0.2: U5.17/A3 37.45,35.6 53.8,35.6 J10.1
E
  Top 0.2: U5.2 13.6,28.97 13.6,52.3 25.15,63.85 26.05,63.85 U6.6
ENC_A
  Bottom 0.2: R4.2 C6.1 55.24,20.8 39.55,20.8 U5.22/A8
ENC_B
  Bottom 0.2: R5.2 C7.1 38.31,19.5 U5.23/A9
GND  (via drill 0.3, 0.4, 0.4 pad 0.41, 0.5)
  Bottom 0.18: 51.45,47.66 51.42,47.64
  Bottom 0.2: U4.TP v54.32,50.03 | C16.1 57.56,53.84 | 47.5,50.42 47.5,50.85 v47.83,51.19 | 47.5,50.42 47.5,50.2 | C10.2 47.5,50.42
  Bottom 0.25: 57.22,47.66 U4.36 57.22,46.68 | 51.42,47.64 U4.11 51.42,46.68 | U4.24 54.57,50.03 v54.32,50.03
  Bottom 0.3: v53.73,52.78 54.55,51.97 54.55,51.79 54.57,51.76 U4.24
  Bottom 0.5: v54.9,22.6 54.84,22.66 C8.2 53.44,22.5 U3.1 | v52.9,31.7 52.8,31.6 C2.2 | v55,31.7 55.1,31.6 C3.2 | C7.2 52.59,19.55 v53.45,19.55 53.5,19.5 C6.2 | v46.95,24.55 47.14,24.36 R6.1 | v49.65,34.45 49.6,34.4 R17.2 | v63.55,30.85 64.57,30.85 C1.2 | U2.1 79.17,43.88 79.18,43.88 79.18,42.92 79.2,42.9 | v33.95,71.85 33.95,72.99 C14.1 | 26.39,73.27 R16.3 26.63,73.27 v26.65,73.25 | R8.3 18.63,73.27 v18.65,73.25
  other vias: 62.01,46.89 61.37,46.89 61.37,49.65 47.98,46.67 48.36,46.1 47.59,46.1 51.32,46.16 56.07,47.78 56.07,48.53 56.07,49.28 56.07,50.03 55.2,47.78 55.2,48.53 55.2,49.28 55.2,50.03 54.32,48.53 54.32,49.28 53.45,48.53 53.45,47.78 53.45,49.28 53.45,50.03 52.57,47.78 52.57,48.53 52.57,49.28 62.01,49.65 62.01,50.67 58.11,45.54 52.57,50.03 47.21,46.67 62.4,54.5 47.98,45.46 47.21,45.46 54.32,47.77 49,29.3 49.4,27.5 76.5,35.4 81.2,35.4 80.8,32.9 70.3,31.9 80,38.1 82.8,37.2 77.7,33.9 77.4,31.7 89.9,31.9 92.3,35.7 88,35.5 91,34.1 85.9,31.1 67.55,33.45 74.4,31.7 93.1,31.7 94.2,40.7 84.2,40.3 78.7,35.5 49,25.7 49.9,25.7 49.9,29.3 49,28.4 49.9,28.4 49,26.6 49.9,26.6 77,40.15 75.25,38.4 77.75,37.65 47,26.4 45.31,46.36 46.11,48.06 44.41,46.26 45.31,45.16 46.21,46.06 44.91,47.56 46.13,51.19 46.13,50.19 52.63,53.88
  pour Bottom (rank 6): 62.64,41.91 62.64,57.15 42.3,57.2 42.3,41.91
  pour Route2 (no thermals): 62.63,41.93 62.63,57.17 42.31,57.17 42.31,41.93
  pour Top (rank 6): 62.64,41.91 62.64,57.15 42.22,57.2 42.22,41.61
  pour Bottom (no thermals): 62.33,46.99 60.74,46.99 60.74,49.05 61.06,49.37 62.33,49.37
  pour Bottom (no thermals): 46.58,46.92 46.58,50.1 48.14,50.11 48.14,49.23 48.48,48.89 48.48,46.92
  pour Route15: 58.82,48.22 57.36,46.76 52.22,46.76 52.22,41.93 42.31,41.93 42.31,48.41 50.69,48.41 52.47,50.44 56.15,50.44 57.42,49.17 58.82,49.17
  pour Bottom (no thermals): 47.1,25.4 50.2,25.4 50.2,29.6 48.7,29.6 48.7,27.1 47.1,27.1
  pour Route15 (rank 2, no thermals): -13.8,-5 -13.8,105 234.2,105 234.2,-5
  pour Bottom (rank 2, no thermals): 94.1,30.4 70.1,30.4 65.7,34.8 65.7,40.5 74,40.5 74,43.85 94.1,43.85
IREF
  Bottom 0.16: 54.07,51.06 U4.23 | U4.23 54.07,51.63 51.57,54.13 | 54.07,51.37 U4.23
  Bottom 0.2: 32,64.5 32,67 | 46.2,54.13 46.2,54.1 | 46.2,54.13 42.37,54.13 40.85,55.65 | 40.85,55.65 40.7,55.8 | 51.57,54.13 46.2,54.13 | IREF_AIN.1 arc45 38.37,53.17 40.85,55.65
  Bottom 0.5: 40.7,55.8 32,64.5 | 32,67 32,68.5 30.05,70.45 R16.2
MECH
  pour Bottom (no thermals): 191,9.5 191,37 95,37 95,9.5
N$1
  Bottom 0.2: R4.1 R2.1 54.5,14.46 54.5,13.7 55.2,13 61,13 S1.A
N$2  (via drill 0.35)
  Top 0.2: S1.3 v61.85,25.85
  Bottom 0.2: R6.2 48.24,22.5 U3.2 50.7,23.46 50.7,25.2 51.35,25.85 v61.85,25.85
N$3
  Bottom 0.2: S1.1 59.58,27.58 U1.3
N$4
  Bottom 0.2: S1.B 65.3,12.3 53.9,12.3 52.54,13.66 R3.1 R5.1
N$5
  pour Top: 95.5,76.5 95.5,10 190.5,10 190.5,76.5
N$6
  Bottom 1.5: J8.4 156.75,73.81 156.75,68.75 153.88,65.88 143.62,65.88 139.19,70.31 J5.1
N$7
  Bottom 1.5: J8.3 151.19,68.06 144.94,68.06 141.73,71.27 J5.2
N$8
  Bottom 1.5: J8.2 150.35,75.25 145.75,75.25 144.27,73.77 J5.3
N$9
  Bottom 1.5: J8.1 148.18,71.13 J5.4
N$10
  Bottom 0.2: S1.2 61.08,27.08 U1.4
N$11
  Bottom 0.203: R8.2 22.05,67.47 U6.3 19.96,65.38 R18.2
N$12
  pour Bottom: 137.5,64.5 137.5,76.5 125.5,76.5 125.5,64.5
OA1  (via drill 0.3)
  Top 1.5: J11.5 53.75,57.25 60.7,64.2 60.7,69.2 58.77,71.13 J2.2
  other vias: 59.95,46.78 58.57,46.78 59.27,46.78
  pour Bottom (rank 2, no thermals): 57.01,48.22 58.45,48.22 58.45,47.15 60.26,47.15 60.26,46.22 58.51,46.22 57.79,46.87 57.79,48.1 57.01,48.1
  pour Top (rank 3, no thermals): 52.45,54.16 52.45,57.16 55.07,57.16 55.07,54.53 58.32,51.78 58.32,48.84 60.45,48.84 60.45,46.16 58.45,46.16 56.7,47.65 56.7,50.28
OA2  (via drill 0.3)
  Top 0.5: v59.03,49.42 58.16,49.42 v58.16,49.36
  Top 1.5: 56.5,55.1 56.5,57.1 62.8,63.4 62.8,70.1 61.31,71.59 J2.1
  other vias: 59.8,49.46
  pour Bottom (rank 3, no thermals): 58.16,50.03 60.45,50.03 60.45,49.16 58.45,49.16 58.45,49.1 57.01,49.1 57.06,49.21 57.37,49.21
  pour Top (rank 4, no thermals): 55.32,57.16 55.32,54.53 58.45,51.78 58.45,49.03 60.45,49.03 60.45,53.21 57.57,55.59 57.57,57.16
OB1  (via drill 0.3)
  Top 1.5: J11.4 51.4,56.06 51.4,57.7 58.45,64.75 58.45,68.45 56.23,70.67 J2.3
  other vias: 50.58,46.92 50.64,47.94 50.01,46.54
  pour Bottom (rank 2, no thermals): 49.63,48.26 51.69,48.26 51.69,48.1 51.06,48.1 50.9,47.94 50.9,46.67 50.42,46.19 49.63,46.19
  pour Top (rank 2, no thermals): 52.45,57.16 49.95,57.09 49.95,50.31 50.45,50.25 50.45,48.91 49.47,48.91 49.47,46.16 50.45,46.16 51.95,47.53 51.95,50.4 52.45,50.91
OB2  (via drill 0.3)
  Top 1.5: J11.3 48.7,55.9 48.7,57.9 56.2,65.4 56.2,67.8 53.69,70.31 J2.4
  other vias: 50.2,49.34 49.56,49.34 48.93,49.34
  pour Bottom (rank 3, no thermals): 48.61,49.9 50.26,49.91 50.97,49.2 51.64,49.2 51.64,49.1 50.92,49.1 50.77,48.95 48.61,48.91
  pour Top (no thermals): 49.63,57.16 47.32,57.16 47.32,50.16 48.26,49.03 50.36,49.03 50.36,49.88 arc-11 49.63,49.89
RS
  Top 0.2: U6.4 23.12,65.12 11.5,53.5 11.5,41.5 7,37 7,33.5 11.5,29 11.5,25.99 U5.0
RW
  Top 0.2: U6.5 12.7,53.04 12.7,27.33 U5.1
SCL
  Bottom 0.2: U1.8 46.82,27.58 R10.2 43.56,26.9 41.07,26.9 U5.19/A5
SD_MODE
  Bottom 0.2: U4.9 52.57,45.76 52.49,45.67 52.49,45.25 52.6,45.14 52.6,41.5 49.4,38.3 37.55,38.3 arc90 U5.16/A2
SDA
  Bottom 0.2: U1.9 44.96,28.08 R9.2 43.56,29.3 41.21,29.3 U5.18/A4
SPI_MODE
  Bottom 0.2: U5.15/A1 48.61,40.71 49.9,42 49.9,43.8 50.35,44.25 51.55,44.25 52.07,44.77 U4.10
STEP  (via drill 0.3)
  Top 0.2: v58.83,45.21 J10.2
  Bottom 0.18: v58.83,45.21 58.33,44.7 54.52,44.7 54.07,45.14 U4.6
  Bottom 0.2: J10.2 52.56,36.9 33.61,36.9 U5.32
SUPPY4
  Bottom 0.2: S1.4 64.58,26.58 U1.5
SW  (via drill 0.35)
  Bottom 0.5: v81.7,42 v81.7,43.2 v81.7,44.2 81.7,45.58 U2.3 81.7,45.61 v81.7,46.9
  other vias: 78.7,42 78.5,43.6 77.9,46.1 75,46.4 75,45.3 77.5,42.7 80,43.5 80.2,42.5 75.9,43.6 76.4,45.6 77.1,44.5
  pour Top (no thermals): 82,47 74.5,47 74.5,41.6 82,41.6
  pour Bottom (no thermals): 74.5,44.7 74.5,57.7 79.6,57.7 79.6,47 78.3,47 78.3,44.7
V_BM
  Bottom 0.2: U1.10 46.78,28.58 R1.1
VCC1
  Bottom 0.2: 55.3,53.8 R7.1 | 55.3,53.8 55.9,53.8 | 55.9,53.8 C16.2 | 55.9,53.8 55.93,53.77 | 55.3,53.8 55.3,52.1 55.57,51.83 U4.26
VCP1
  Bottom 0.2: C12.2 57.9,52 57.22,51.32 U4.29
VREF2
  Bottom 0.5: R13.1 28.77,74.77 27.8,73.8 27.8,71.9 26.63,70.73 R16.1

### Text on the board
Top: TWISTER 3
Dimension: V-CUT | V-CUT
tPlace: M3 | Twister 3 Control Board / CERN OHL v1.2 / Jon Newman & Open Ephys / MIT 2018 | SilentStepStick / Compatible | VM | GND | M2B | M2A | M1A | M1B | VIO | GND | TMC2130 | En | SDI | SCK | CS | SDO | Step | Dir | M1 | M2
bPlace: M5 | +5V | GND | IREF_AIN | +3.3V | M4 | M6
tStop: TWISTER 3
tDocu: - Board to panel stack height: 12 mm. / - Teensy goes on bottom with top of teensy facing up (when board is flipped) / - Silent stepper stick goes on bottom with top of module facing down (whe board flipped) | Top Board Origin